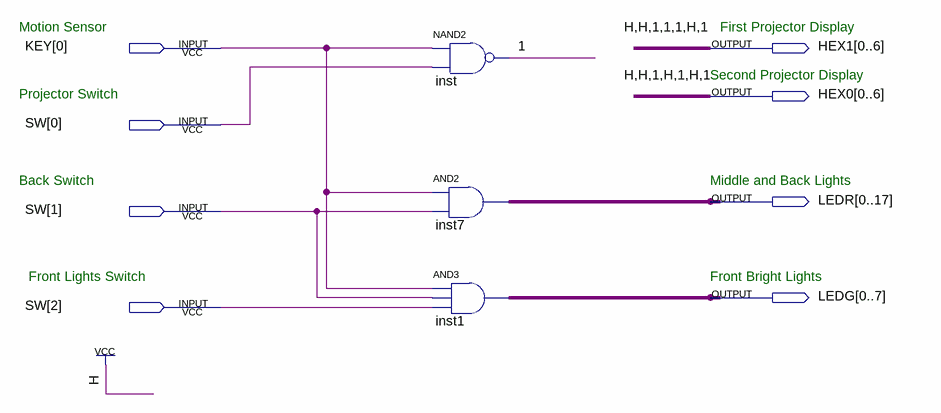
[diagram p0: schematic sheet]
// Quartus schematic Lab1.bdf as structural Verilog: 3 symbols, 8 pins
module Lab1 (
  input  [0:0] KEY,
  input  [2:0] SW,
  output [0:6] HEX1,
  output [0:6] HEX0,
  output [0:17] LEDR,
  output [0:7] LEDG
);

  nand inst (HEX0[6], KEY[0], SW[0]);
  assign LEDR = {18{KEY[0]}} & {18{SW[1]}};  // AND2 inst7, 18 bits wide
  assign LEDG = {8{KEY[0]}} & {8{SW[1]}} & {8{SW[2]}};  // AND3 inst1, 8 bits wide

  assign HEX0[0:5] = {2'b11, HEX0[6], 1'b1, HEX0[6], 1'b1};
  assign HEX1 = {2'b11, {3{HEX0[6]}}, 1'b1, HEX0[6]};

  // Other names for the same wires on the sheet: 1 = HEX0[6]

  // Notes on the sheet:
  //   Motion Sensor
  //   First Projector Display
  //   Second Projector Display
  //   Projector Switch
  //   Back Switch
  //   Middle and Back Lights
  //   Front Lights Switch
  //   Front Bright Lights
endmodule
